# EAGLE design v0.9 (EAGLE 6.1)
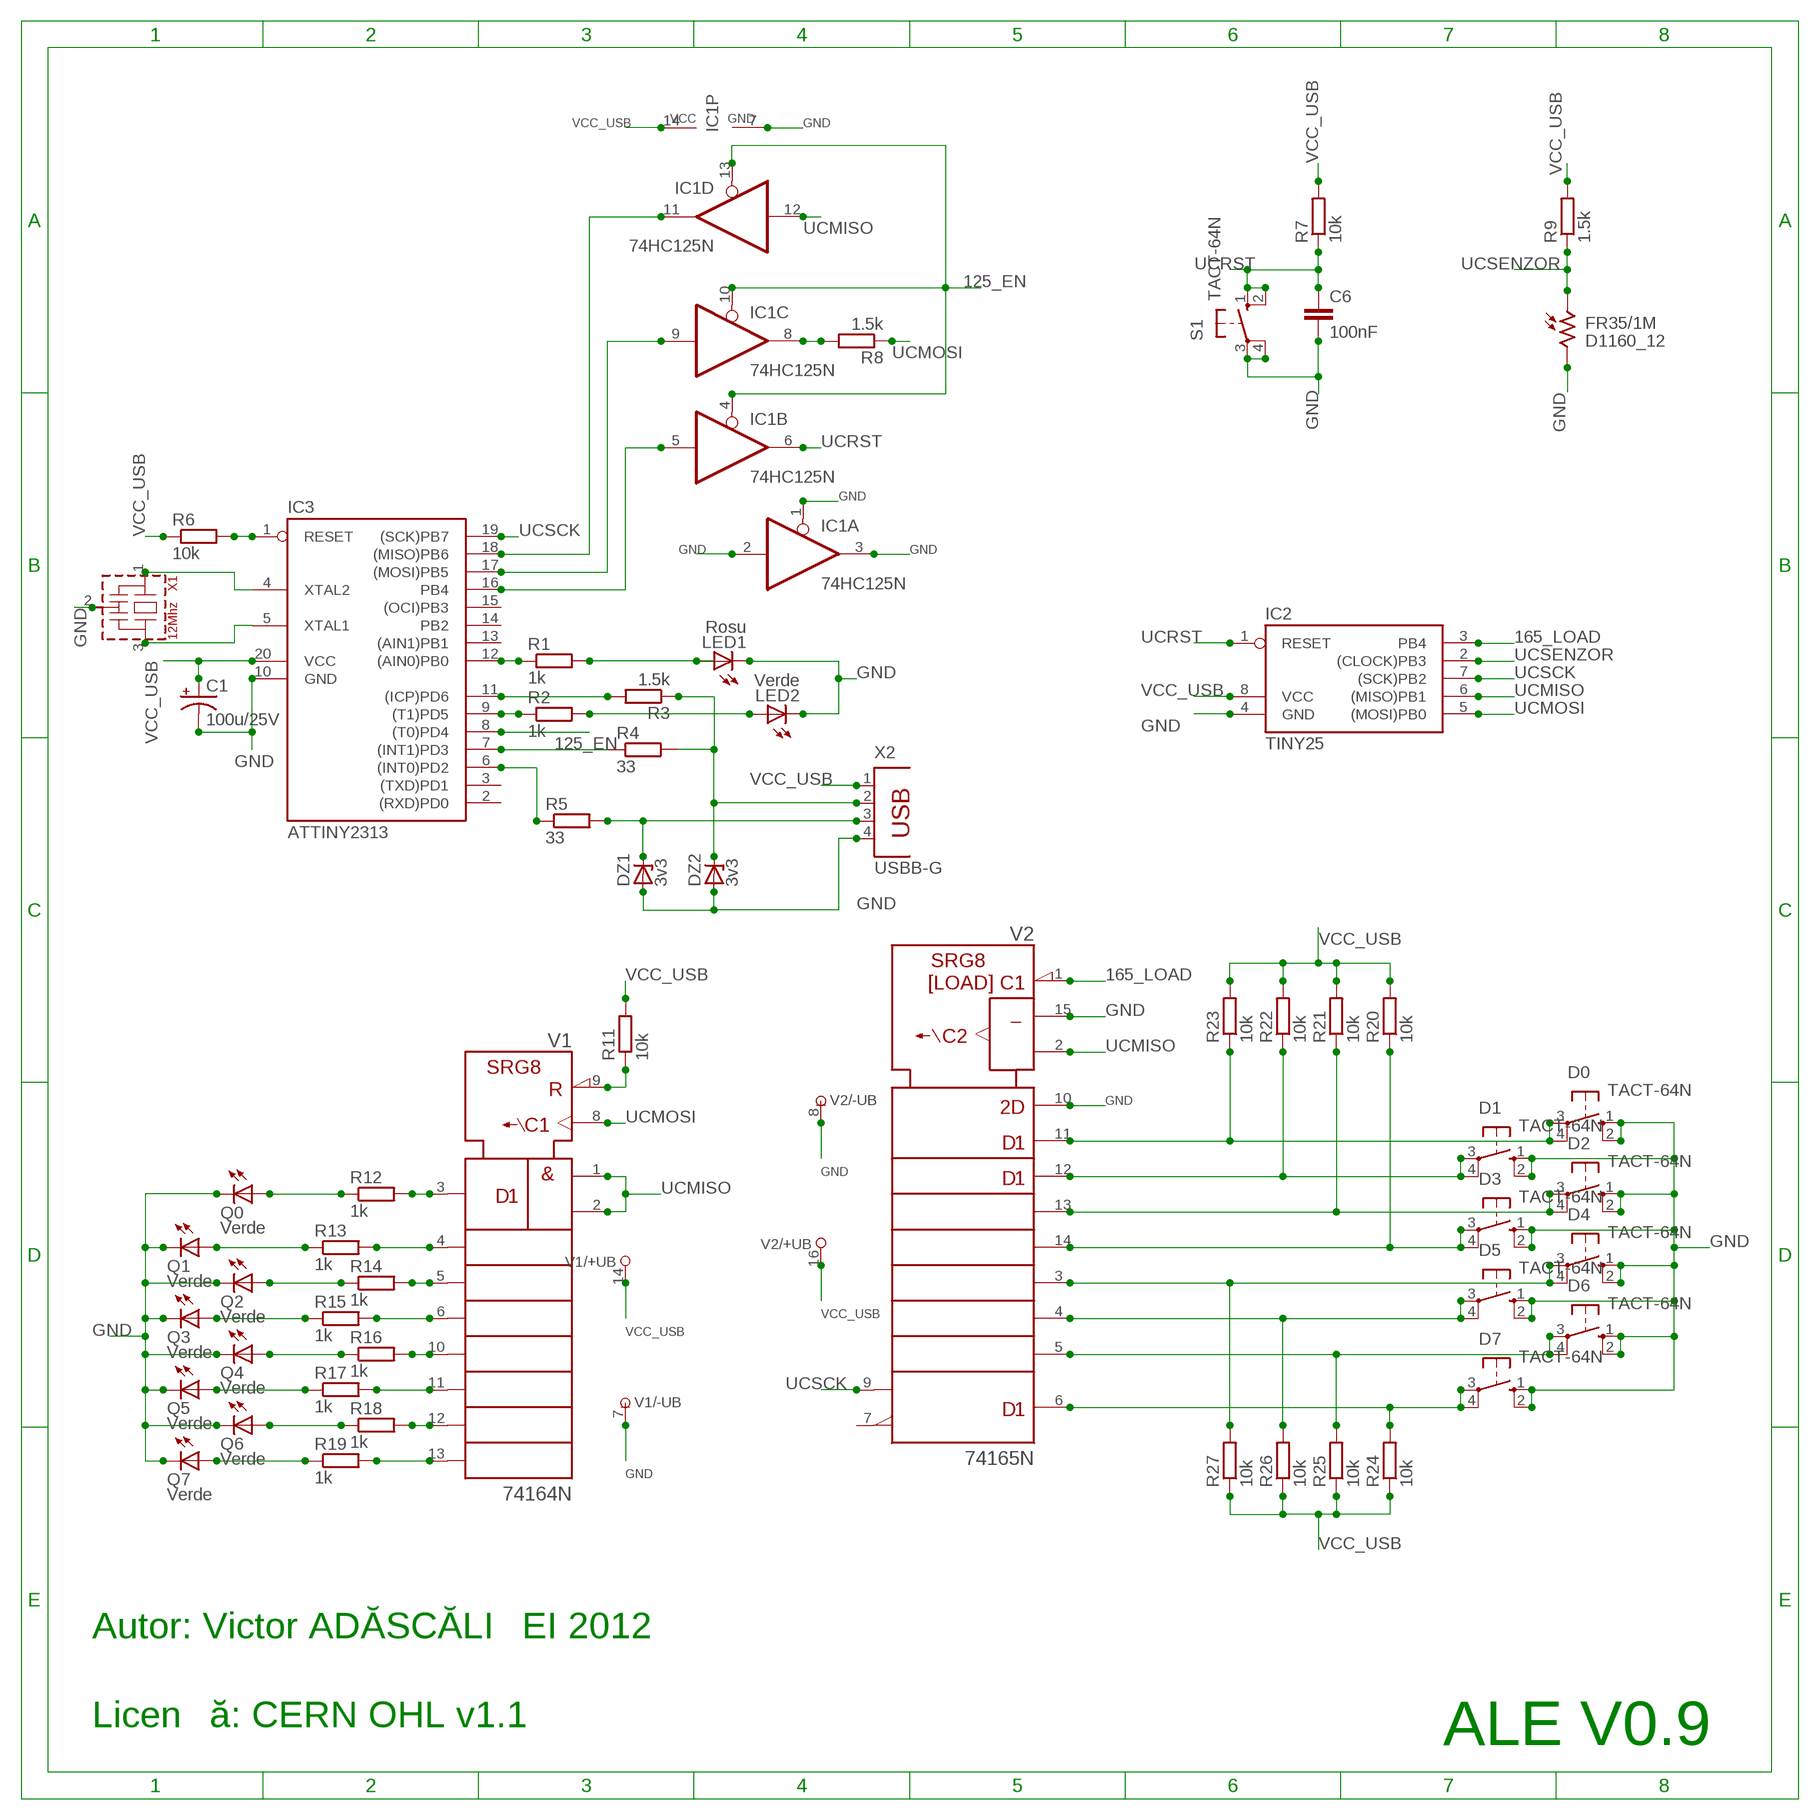
[diagram p0: schematic, sheet 1]

## Parts
C1  100u/25V  CPOL-USE2.5-6  [E2,5-6]
C6  100nF  C-EU050-025X075  [C050-025X075]
D0  TACT-64N  10-XX  [B3F-10XX]
D1  TACT-64N  10-XX  [B3F-10XX]
D2  TACT-64N  10-XX  [B3F-10XX]
D3  TACT-64N  10-XX  [B3F-10XX]
D4  TACT-64N  10-XX  [B3F-10XX]
D5  TACT-64N  10-XX  [B3F-10XX]
D6  TACT-64N  10-XX  [B3F-10XX]
D7  TACT-64N  10-XX  [B3F-10XX]
DZ1  3v3  ZENER-DIODEZD-7.5  [ZDIO-7.5]
DZ2  3v3  ZENER-DIODEZD-7.5  [ZDIO-7.5]
FR35/1M  D1160_12  [D11XX]
IC1  74HC125N  74AC125N  [DIL14]
IC2  TINY25  TINY22P  [DIL08]
IC3  ATTINY2313  AT90S2313P  [DIL20]
LED1  Rosu  LED3MM  [LED3MM]
LED2  Verde  LED3MM  [LED3MM]
Q0  Verde  LED3MM  [LED3MM]
Q1  Verde  LED3MM  [LED3MM]
Q2  Verde  LED3MM  [LED3MM]
Q3  Verde  LED3MM  [LED3MM]
Q4  Verde  LED3MM  [LED3MM]
Q5  Verde  LED3MM  [LED3MM]
Q6  Verde  LED3MM  [LED3MM]
Q7  Verde  LED3MM  [LED3MM]
R1  1k  R-EU_0207/10  [0207/10]
R2  1k  R-EU_0204/5  [0204/5]
R3  1.5k  R-EU_0207/10  [0207/10]
R4  33  R-EU_0207/12  [0207/12]
R5  33  R-EU_0207/10  [0207/10]
R6  10k  R-EU_0207/10  [0207/10]
R7  10k  R-EU_0204/7  [0204/7]
R8  1.5k  R-EU_0207/10  [0207/10]
R9  1.5k  R-EU_0207/12  [0207/12]
R11  10k  R-EU_0207/15  [0207/15]
R12  1k  R-EU_0207/10  [0207/10]
R13  1k  R-EU_0207/10  [0207/10]
R14  1k  R-EU_0207/10  [0207/10]
R15  1k  R-EU_0207/10  [0207/10]
R16  1k  R-EU_0207/10  [0207/10]
R17  1k  R-EU_0207/10  [0207/10]
R18  1k  R-EU_0207/10  [0207/10]
R19  1k  R-EU_0207/10  [0207/10]
R20  10k  R-EU_0207/10  [0207/10]
R21  10k  R-EU_0207/10  [0207/10]
R22  10k  R-EU_0204/7  [0204/7]
R23  10k  R-EU_0204/7  [0204/7]
R24  10k  R-EU_0207/10  [0207/10]
R25  10k  R-EU_0207/10  [0207/10]
R26  10k  R-EU_0207/10  [0207/10]
R27  10k  R-EU_0207/10  [0207/10]
S1  TACT-64N  10-XX  [B3F-10XX]
V1  74164N  [DIL14]
V2  74165N  [DIL16]
X1  12Mhz  CSTLS_X  [CSTLS_X]
X2  USBB-G  PN61729  [PN61729]

## Nets
125_EN: IC1.4(B:OE) IC1.10(C:OE) IC1.13(D:OE) IC3.8((T0)PD4)
165_LOAD: IC2.3(PB4) V2.1(SH/!LD)
GND: C1.- C6.2 D0.1(S) D0.2(S1) D1.1(S) D1.2(S1) D2.1(S) D2.2(S1) D3.1(S) D3.2(S1) D4.1(S) D4.2(S1) D5.1(S) D5.2(S1) D6.1(S) D6.2(S1) D7.1(S) D7.2(S1) DZ1.A DZ2.A FR35/1M.2 IC1.1(A:OE) IC1.2(A:I) IC1.3(A:O) IC1.7(P:GND) IC2.4(GND) IC3.10(GND) LED1.K(C) LED2.K(C) Q0.K(C) Q1.K(C) Q2.K(C) Q3.K(C) Q4.K(C) Q5.K(C) Q6.K(C) Q7.K(C) S1.3(P) S1.4(P1) V1.7(-UB) V2.8(-UB) V2.10(SER) V2.15(CLK_INH) X1.2(VSS) X2.4
N$1: IC1.5(B:I) IC3.16(PB4)
N$2: IC1.9(C:I) IC3.17((MOSI)PB5)
N$4: IC1.8(C:O) R8.2
N$5: IC1.11(D:O) IC3.18((MISO)PB6)
N$6: R11.1 V1.9(!CLR)
N$7: IC3.1(RESET) R6.2
N$8: IC3.7((INT1)PD3) R4.1
N$9: LED2.A R2.2
N$10: IC3.9((T1)PD5) R2.1
N$11: D0.3(P) D0.4(P1) R23.1 V2.11(A)
N$12: Q0.A R12.1
N$13: IC3.12((AIN0)PB0) R1.1
N$14: LED1.A R1.2
N$15: IC3.6((INT0)PD2) R5.1
N$16: IC3.11((ICP)PD6) R3.2
N$17: DZ2.C R3.1 R4.2 X2.2
N$18: IC3.4(XTAL2) X1.1
N$19: DZ1.C R5.2 X2.3
N$20: IC3.5(XTAL1) X1.3
N$21: Q1.A R13.1
N$22: Q2.A R14.1
N$23: Q3.A R15.1
N$24: Q4.A R16.1
N$25: Q5.A R17.1
N$26: Q6.A R18.1
N$27: Q7.A R19.1
N$28: R12.2 V1.3(QA)
N$29: R13.2 V1.4(QB)
N$30: R14.2 V1.5(QC)
N$31: R15.2 V1.6(QD)
N$32: R16.2 V1.10(QE)
N$33: R17.2 V1.11(QF)
N$34: R18.2 V1.12(QG)
N$35: R19.2 V1.13(QH)
N$36: D1.3(P) D1.4(P1) R22.1 V2.12(B)
N$37: D2.3(P) D2.4(P1) R21.1 V2.13(C)
N$38: D3.3(P) D3.4(P1) R20.1 V2.14(D)
N$39: D4.3(P) D4.4(P1) R27.2 V2.3(E)
N$40: D5.3(P) D5.4(P1) R26.2 V2.4(F)
N$41: D6.3(P) D6.4(P1) R25.2 V2.5(G)
N$42: D7.3(P) D7.4(P1) R24.2 V2.6(H)
UCMISO: IC1.12(D:I) IC2.6((MISO)PB1) V1.1(A) V1.2(B) V2.2(CLK)
UCMOSI: IC2.5((MOSI)PB0) R8.1 V1.8(CLK)
UCRST: C6.1 IC1.6(B:O) IC2.1(RESET) R7.1 S1.1(S) S1.2(S1)
UCSCK: IC2.7((SCK)PB2) IC3.19((SCK)PB7) V2.9(QH)
UCSENZOR: FR35/1M.1 IC2.2((CLOCK)PB3) R9.1
VCC_USB: C1.+ IC1.14(P:VCC) IC2.8(VCC) IC3.20(VCC) R6.1 R7.2 R9.2 R11.2 R20.2 R21.2 R22.2 R23.2 R24.1 R25.1 R26.1 R27.1 V1.14(+UB) V2.16(+UB) X2.1
Unconnected: IC3.2((RXD)PD0) IC3.3((TXD)PD1) IC3.13((AIN1)PB1) IC3.14(PB2) IC3.15((OCI)PB3) V2.7(!QH)

## Notes on the sheet
- Autor: Victor ADĂSCĂLIȚEI 2012
- Licență: CERN OHL v1.1
- ALE V0.9

## Library data of the parts
C1 = rcl:CPOL-US: POLARIZED CAPACITOR, American symbol
C6 = rcl:C-EU: CAPACITOR, European symbol
D0 D1-D7 S1 = switch-omron:10-XX: OMRON SWITCH
DZ1 DZ2 = diode:ZENER-DIODE: Z-Diode
FR35/1M = photo-elements:D11: Photo Sensor Oil Burner Control Applications Source: http://optoelectronics.perkinelmer.com/content/Datasheets/DTS_PhotocellsD1160.pdf
IC1 = 74xx-eu:74*125: Quad bus BUFFER, 3-state
IC2 = atmel:TINY22: MICROCONTROLLER 1K ROM 128 bytes RAM 128 bytes EEPROM
IC3 = atmel:AT90S2313: MICROCONTROLLER 2 Kbytes FLASH 128 bytes SRAM 128 bytes EEPROM UART
LED1 LED2 Q0 Q1-Q7 = led:LED: LED OSRAM: - CHIPLED LG R971, LG N971, LY N971, LG Q971, LY Q971, LO R971, LY R971 LH N974, LH R974 LS Q976, LO Q976, LY Q976 LO Q996 - Hyper CHIPLED LW Q18S LB Q993, LB Q99A, LB R99A - SideLED LS A670, LO A670, LY A670, LG A670, LP A670 LB A673, LV A673, LT A673, LW A673 LH A674 LY A675 LS A676, LA A676, LO A676, LY A676, LW A676 LS A679, LY A679, LG A679 - Hyper Micro SIDELED® LS Y876, LA Y876, LO Y876, LY Y876 LT Y87S - SmartLED LW L88C, LW L88S LB L89C, LB L89S, LG L890 LS L89K, LO L89K, LY L89K LS L896, LA L896, LO L896, LY L896 - TOPLED LS T670, LO T670, LY T670, LG T670, LP T670 LSG T670, LSP T670, LSY T670, LOP T670, LYG T670 LG T671, LOG T671, LSG T671 LB T673, LV T673, LT T673, LW T673 LH T674 LS T676, LA T676, LO T676, LY T676, LB T676, LH T676, LSB T676, LW T676 LB T67C, LV T67C, LT T67C, LS T67K, LO T67K, LY T67K, LW E67C LS E67B, LA E67B, LO E67B, LY E67B, LB E67C, LV E67C, LT E67C LW T67C LS T679, LY T679, LG T679 LS T770, LO T770, LY T770, LG T770, LP T770 LB T773, LV T773, LT T773, LW T773 LH T774 LS E675, LA E675, LY E675, LS T675 LS T776, LA T776, LO T776, LY T776, LB T776 LHGB T686 LT T68C, LB T68C - Hyper Mini TOPLED® LB M676 - Mini TOPLED Santana® LG M470 LS M47K, LO M47K, LY M47K Source: http://www.osram.convergy.de LUXEON: - LUMILED® LXK2-PW12-R00, LXK2-PW12-S00, LXK2-PW14-U00, LXK2-PW14-V00 LXK2-PM12-R00, LXK2-PM12-S00, LXK2-PM14-U00 LXK2-PE12-Q00, LXK2-PE12-R00, LXK2-PE12-S00, LXK2-PE14-T00, LXK2-PE14-U00 LXK2-PB12-K00, LXK2-PB12-L00, LXK2-PB12-M00, LXK2-PB14-N00, LXK2-PB14-P00, LXK2-PB14-Q00 LXK2-PR12-L00, LXK2-PR12-M00, LXK2-PR14-Q00, LXK2-PR14-R00 LXK2-PD12-Q00, LXK2-PD12-R00, LXK2-PD12-S00 LXK2-PH12-R00, LXK2-PH12-S00 LXK2-PL12-P00, LXK2-PL12-Q00, LXK2-PL12-R00 Source: www.luxeon.com KINGBRIGHT: KA-3528ASYC Source: www.kingbright.com
R1-R9 R11-R27 = rcl:R-EU_: RESISTOR, European symbol
V1 = 74ttl-din:74*164: 8-bit parallel out SHIFT REGISTER
V2 = 74ttl-din:74*165: 8-bit parallel load SHIFT REGISTER
X1 = murata-resonators:CSTLS_X: Ceramic resonator 16.00 to 70.00 MHz
X2 = con-berg:PN61729: BERG USB connector

## Board
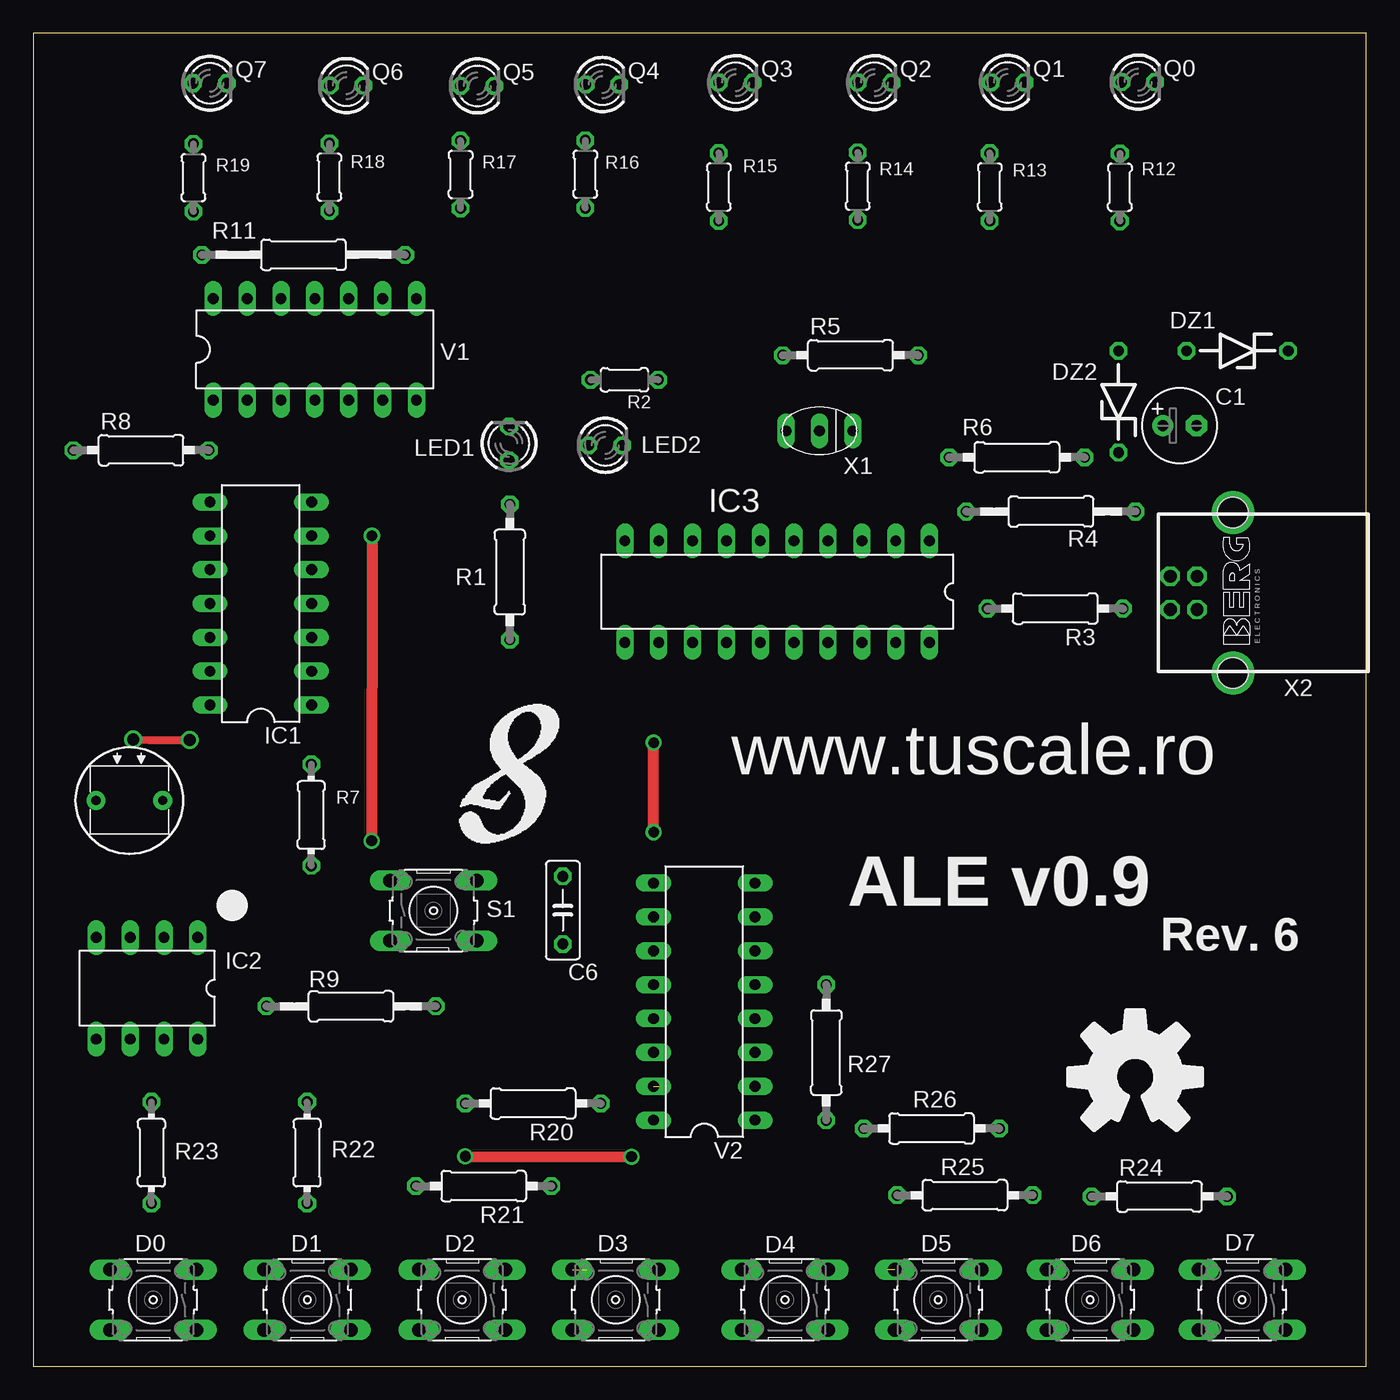
[diagram p1: board, top side]
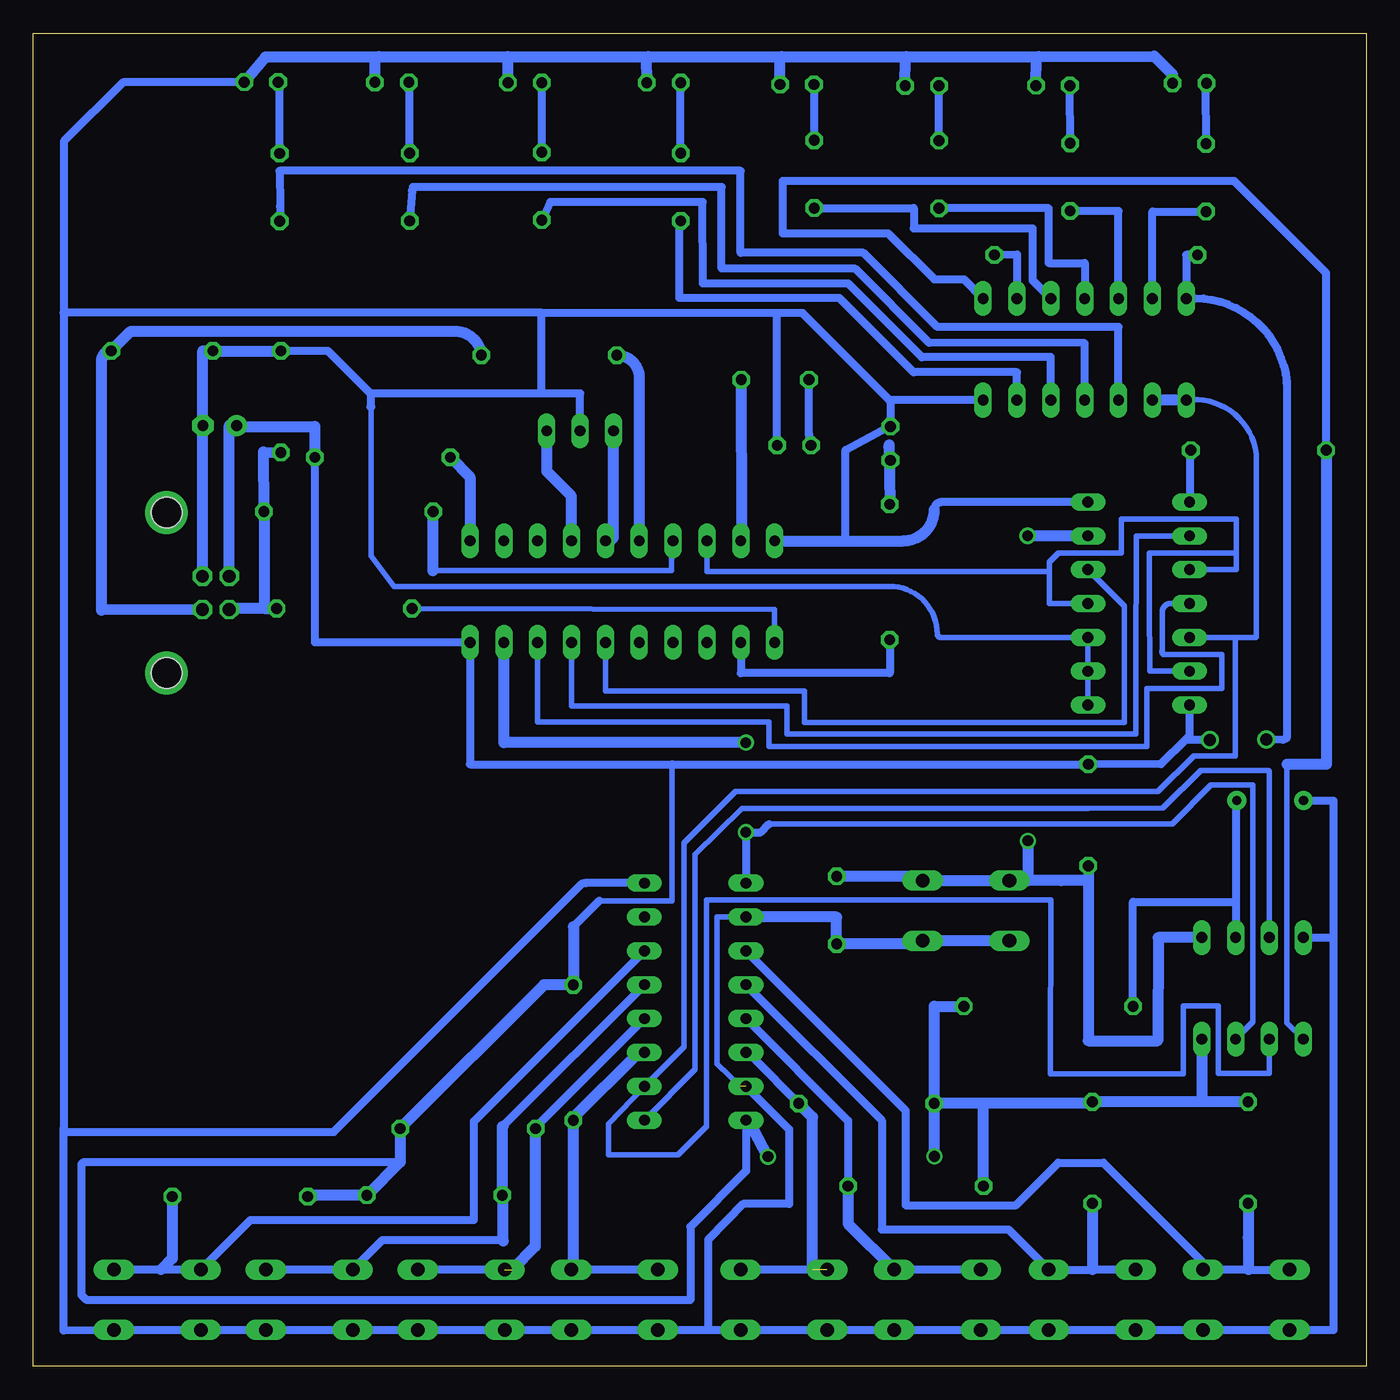
[diagram p2: board, bottom side, seen from below]

Size 100 x 100 mm. Coordinates in mm from the lower left corner, seen from the top.
Outline: 0,0 100,0 100,100 0,100 0,0
Copper layers (1*16): Top 0.035mm / dielectric 1.5mm / Bottom 0.035mm
Design rules "default": minimum track width 0.25mm, minimum drill 0.6mm, track to track 0.25mm, track to pad 8mil, pad to pad 8mil, via to via 8mil, smd to smd 8mil, copper to edge 40mil, drill to drill 8mil, minimum pad ring 10mil, minimum via ring 8mil, stop-mask expansion 4mil, vias tented up to drill 0mil, thermal gap 10mil

### Footprints (pad centres in the part's own frame; a part is rotated, then mirrored left to right if it is on the bottom)
E2,5-6 = drill 0.813 pad 1.6: + -1.27,0 | drill 0.813 pad 1.6 octagon: - 1.27,0
C050-025X075 = drill 0.813 octagon: 1 -2.54,0; 2 2.54,0
B3F-10XX = drill 1.016 long: 1 -3.251,2.261; 2 3.251,2.261; 3 -3.251,-2.261; 4 3.251,-2.261
ZDIO-7.5 = drill 0.813 octagon: A 3.81,0; C -3.81,0
D11XX = drill 0.7 pad 1.4: 1 -2.5,0; 2 2.5,0
DIL14 = drill 0.813 long: 1 -7.62,-3.81; 2 -5.08,-3.81; 3 -2.54,-3.81; 4 0,-3.81; 5 2.54,-3.81; 6 5.08,-3.81; 7 7.62,-3.81; 8 7.62,3.81; 9 5.08,3.81; 10 2.54,3.81; 11 0,3.81; 12 -2.54,3.81; 13 -5.08,3.81; 14 -7.62,3.81
DIL08 = drill 0.813 long: 1 -3.81,-3.81; 2 -1.27,-3.81; 3 1.27,-3.81; 4 3.81,-3.81; 5 3.81,3.81; 6 1.27,3.81; 7 -1.27,3.81; 8 -3.81,3.81
DIL20 = drill 0.813 long: 1 -11.43,-3.81; 2 -8.89,-3.81; 3 -6.35,-3.81; 4 -3.81,-3.81; 5 -1.27,-3.81; 6 1.27,-3.81; 7 3.81,-3.81; 8 6.35,-3.81; 9 8.89,-3.81; 10 11.43,-3.81; 11 11.43,3.81; 12 8.89,3.81; 13 6.35,3.81; 14 3.81,3.81; 15 1.27,3.81; 16 -1.27,3.81; 17 -3.81,3.81; 18 -6.35,3.81; 19 -8.89,3.81; 20 -11.43,3.81
LED3MM = drill 0.813 octagon: A -1.27,0; K 1.27,0
0207/10 = drill 0.813 octagon: 1 -5.08,0; 2 5.08,0
0204/5 = drill 0.813 octagon: 1 -2.54,0; 2 2.54,0
0207/12 = drill 0.813 octagon: 1 -6.35,0; 2 6.35,0
0204/7 = drill 0.813 octagon: 1 -3.81,0; 2 3.81,0
0207/15 = drill 0.813 octagon: 1 -7.62,0; 2 7.62,0
DIL16 = drill 0.813 long: 1 -8.89,-3.81; 2 -6.35,-3.81; 3 -3.81,-3.81; 4 -1.27,-3.81; 5 1.27,-3.81; 6 3.81,-3.81; 7 6.35,-3.81; 8 8.89,-3.81; 9 8.89,3.81; 10 6.35,3.81; 11 3.81,3.81; 12 1.27,3.81; 13 -1.27,3.81; 14 -3.81,3.81; 15 -6.35,3.81; 16 -8.89,3.81
CSTLS_X = drill 0.813 long: 1 -2.5,0; 2 0,0; 3 2.5,0
PN61729 = drill 0.95 octagon: 1 1.25,4.71; 2 -1.25,4.71; 3 -1.25,2.71; 4 1.25,2.71 | hole 2.3: -6.02,0; 6.02,0

### Placement (x,y rotation side)
C1  86.01,70.57 0 top
C6  39.73,34.21 270 top
D0  8.99,4.98 180 top
D1  20.56,4.98 180 top
D2  32.16,4.98 180 top
D3  43.69,4.98 180 top
D4  56.39,4.98 180 top
D5  67.89,4.98 180 top
D6  79.29,4.98 180 top
D7  90.69,4.98 180 top
DZ1  90.34,76.18 180 top
DZ2  81.42,72.36 90 top
FR35/1M  7.21,42.44 180 top
IC1  17.06,57.22 90 top
IC2  8.53,28.35 180 top
IC3  55.81,58.11 180 top
LED1  35.69,69.23 90 top
LED2  42.92,69.09 0 top
Q0  82.9,96.34 0 top
Q1  73.1,96.32 0 top
Q2  63.12,96.3 0 top
Q3  52.7,96.3 0 top
Q4  42.7,96.16 0 top
Q5  33.32,96.06 0 top
Q6  23.5,96.08 0 top
Q7  13.25,96.26 0 top
R1  35.75,59.58 90 top
R2  44.35,74.01 180 top
R3  76.67,56.84 180 top
R4  76.35,64.12 0 top
R5  61.31,75.85 0 top
R6  73.79,68.19 180 top
R7  20.85,41.35 90 top
R8  8.08,68.72 0 top
R9  23.84,27 0 top
R11  20.27,83.38 180 top
R12  1k  [0204/5]  81.52,88.45 270 top
R13  1k  [0204/5]  71.76,88.47 270 top
R14  1k  [0204/5]  61.85,88.53 270 top
R15  1k  [0204/5]  51.43,88.47 270 top
R16  1k  [0204/5]  41.41,89.43 270 top
R17  1k  [0204/5]  32.05,89.41 270 top
R18  1k  [0204/5]  22.21,89.21 270 top
R19  1k  [0204/5]  12.01,89.17 270 top
R20  37.49,19.71 180 top
R21  33.79,13.51 180 top
R22  20.54,16.02 90 top
R23  8.86,16.02 90 top
R24  84.49,12.73 0 top
R25  69.89,12.83 180 top
R26  67.39,17.83 180 top
R27  59.49,23.53 270 top
S1  30.02,34.18 0 top
V1  21.12,76.29 0 top
V2  50.34,27.35 90 top
X1  58.98,70.18 180 top
X2  90.01,58.02 90 top

### Tracks (layer width: path | path; a pad name or v marks a point on that pad's centre or on a via)
125_EN
  Bottom 0.406: IC1.10 9.76,59.76 9.76,61 | IC1.13 16.25,52.14 16.26,57.29 16.26,60.99 9.77,60.99 9.76,61 | 9.76,61 9.76,63.56 18.36,63.56 18.36,61 23.1,61 23.78,60.32 23.78,59.62 | IC1.4 23.78,57.22 23.78,59.62 | IC3.8 49.46,59.62 23.78,59.62
165_LOAD
  Bottom 0.406: V2.1 50.34,22.27 50.34,38.38 46.82,41.86 20.84,41.86 15.25,41.87 12.4,44.7 7.35,44.7 7.26,44.61 IC2.3
GND  (1 unrouted)
  Bottom 0.406: IC1.1 IC1.2 IC1.3 31.92,54.68 arc90 32.18,54.94 arc-90 35.75,58.51 72.92,58.51 74.65,60.77 74.65,71.96 | 46.96,21 48.7,22.67 48.7,33.7 V2.10
  Bottom 0.61: X1.2 58.98,72.98 61.88,72.98 | 61.88,72.98 74.7,72.98 | 74.7,72.98 74.7,71.96 74.65,71.96 | 74.7,72.98 77.89,76.17 DZ2.A | 44.2,79 42.28,79.01 35.78,72.48 35.65,72.48 | 44.2,79 61.86,79 61.88,79.04 | LED2.K 44.2,79 | V1.7 35.65,72.48 | 61.88,79.04 97.73,79.04 | FR35/1M.2 2.44,42.44 2.44,32.16 | 2.44,32.16 2.44,2.72 D0.2 D0.1 D1.2 D1.1 D2.2 D2.1 D3.2 D3.1 49.36,2.72 | IC2.4 2.44,32.16 | 49.36,2.72 D4.2 D4.1 D5.2 D5.1 D6.2 D6.1 D7.2 D7.1 97.75,2.69 97.75,17.58 | 97.73,79.04 97.73,17.84 97.75,17.58 | 97.75,17.58 77.46,17.58 58.88,36.18 58.56,36.24 V2.8 | 61.88,72.98 61.88,79.04 | V2.15 43.3,17.77 43.3,12.18 46.74,12.18 49.36,9.51 49.36,2.72 | 34.74,61.92 39.04,61.92 arc90 39.06,61.94 39.06,68.75 35.8,70.5 LED1.K 35.65,70.54 35.65,72.48 | IC1.7 31.82,64.84 arc-90 32.4,64.26 | Q0.K 93.26,96.33 97.7,91.89 97.73,79.04
  Bottom 0.813: V2.10 39.73,33.7 C6.2 33.27,31.67 S1.4 S1.3 | DZ2.A DZ1.A 87.28,76.18 C1.- 87.3,70.57 X2.4 | Q0.K 82.58,98.23 74.08,98.25 | 74.08,98.25 64.39,98.25 | 64.39,98.25 53.85,98.25 | 53.85,98.25 43.86,98.25 | 43.86,98.25 34.53,98.25 | 34.53,98.25 24.57,98.25 | 24.57,98.25 15.91,98.29 14.52,96.9 Q7.K | Q1.K 74.37,98.17 74.08,98.25 | Q2.K 64.39,98.25 | Q3.K 53.99,98.23 53.85,98.25 | Q4.K 43.97,98.16 43.86,98.25 | Q5.K 34.57,98.22 34.53,98.25 | Q6.K 24.75,98.24 24.57,98.25 | IC3.10 34.74,61.92 arc-90 32.4,64.26
N$1
  Bottom 0.406: IC1.5 18.16,57.05 18.16,48.31 42.16,48.31 42.16,50.65 57.08,50.65 IC3.16
N$2
  Bottom 0.406: IC1.9 17.26,62.28 17.29,52.09 17.3,47.95 17.29,47.45 43.47,47.45 43.47,49.54 59.62,49.54 IC3.17
N$3  (via drill 2.2 pad 1.02)
  other vias: 90.01,52
N$4
  Bottom 0.61: R8.2 13.25,68.74 IC1.8
N$5
  Bottom 0.406: IC1.11 14.75,57.22 arc-90 15.3,56.49 15.3,53.7 arc-90 15.16,53.38 10.82,53.38 10.82,50.84 16.46,50.84 16.47,47.03 16.47,46.48 44.82,46.48 44.82,48.32 62.16,48.32 IC3.18
N$6
  Bottom 0.61: R11.1 26.2,83.42 V1.9
N$7
  Bottom 0.813: R6.2 67.24,66.72 IC3.1
N$8
  Bottom 0.406: IC3.7 52.11,62.03 52.11,59.68 70.01,59.68 | R4.1
  Bottom 0.813: 70.01,59.68 R4.1
N$9
  Bottom 0.61: LED2.A 41.79,69.92 R2.2
N$10
  Bottom 0.813: R2.1 46.86,63.08 IC3.9
N$11
  Bottom 0.61: D0.4 8.84,7.24 11.69,7.24 | 11.69,7.24 D0.3 12.2,7.24 | V2.11 34.56,19.19 34.56,12.08 26.28,12.08 23.1,15.26 19.71,15.26 11.69,7.24
  Bottom 0.813: 8.84,7.24 8.84,9.64 8.86,9.66 R23.1
N$12
  Bottom 0.61: R12.1 81.51,96.18 Q0.A
N$13
  Bottom 0.61: R1.1 35.75,52 46.92,52 IC3.12
N$14
  Bottom 0.813: LED1.A 35.79,69.11 R1.2
N$15
  Bottom 0.813: R5.1 arc90 54.54,74.16 IC3.6
N$16
  Bottom 0.406: IC3.11 44.38,56.76 71.77,56.83 arc90 R3.2
N$17
  Bottom 0.406: R4.2
  Bottom 0.813: DZ2.C 82.72,68.59 R4.2 82.7,56.85 R3.1 85.27,56.84 X2.2
N$18
  Bottom 0.813: IC3.4 59.62,65.28 61.46,67.12 61.46,70.16 X1.1
N$19
  Bottom 0.813: X2.3 94.88,56.72 94.88,75.45 arc90 DZ1.C 92.69,77.64 68.54,77.64 arc90 R5.2
N$20
  Bottom 0.813: IC3.5 56.98,61.82 56.98,61.66 56.48,62.16 X1.3
N$21
  Bottom 0.61: R13.1 71.77,95.99 Q1.A
N$22
  Bottom 0.61: R14.1 Q2.A
N$23
  Bottom 0.61: R15.1 Q3.A
N$24
  Bottom 0.61: R16.1 41.41,95.75 Q4.A
N$25
  Bottom 0.61: R17.1 Q5.A
N$26
  Bottom 0.61: R18.1 22.23,95.91 Q6.A
N$27
  Bottom 0.61: R19.1 12.02,96.08 Q7.A
N$28
  Bottom 0.61: V1.3 18.58,77.97 32.16,77.97 37.72,83.53 46.93,83.53 46.94,89.68 81.52,89.68 81.5,87.01 R12.2
N$29
  Bottom 0.61: V1.4 21.12,76.75 32.79,76.79 38.33,82.33 48.36,82.35 48.36,88.46 71.52,88.46 71.6,88.21 R13.2
N$30
  Bottom 0.61: V1.5 23.66,75.71 33.35,75.7 38.86,81.22 49.76,81.22 49.78,87.34 61.22,87.34 R14.2
N$31
  Bottom 0.61: V1.6 26.2,74.57 33.96,74.57 39.52,80.14 51.54,80.14 51.54,85.82 R15.2
N$32
  Bottom 0.61: V1.10 25.04,81.48 25.04,85.37 33.94,85.37 33.94,86.89 R16.2
N$33
  Bottom 0.61: V1.11 21.12,82.77 23.82,82.77 23.82,86.87 R17.2
N$34
  Bottom 0.61: V1.12 18.58,86.67 R18.2
N$35
  Bottom 0.61: V1.13 16.04,86.63 R19.2
N$36
  Bottom 0.61: D1.4 20.54,7.24 D1.3 26.81,10.24 36.34,10.24 36.34,18.43 V2.12
  Bottom 0.813: R22.1 20.54,7.24
N$37
  Bottom 0.61: D2.4 D2.3 | V2.13 38.87,18.42 R21.1
  Bottom 0.813: R21.1 38.87,10.7 D2.3
N$38  (1 unrouted)
  Bottom 0.406: R20.1 42.7,19.71
  Bottom 0.61: D3.4 D3.3 | V2.14 46.4,23.54 42.21,19.35
  Bottom 0.813: 41.54,7.24 41.54,18.68 42.21,19.35 R20.1
N$39
  Bottom 0.61: D4.4 D4.3
  Bottom 0.813: D4.3 59.49,7.39 R27.2 59.49,18.63 54.68,23.44 54.25,23.44 V2.3
N$40  (1 unrouted)
  Bottom 0.406: 62.34,17.89 62.3,17.93 62.3,17.84 R26.2
  Bottom 0.61: D5.4 D5.3 | V2.4 62.31,17.92 R26.2
  Bottom 0.813: 62.34,17.89 62.34,8.98 64.08,7.24
N$41
  Bottom 0.61: D6.3 D6.4 73.83,9.45 64.81,9.45 | V2.5 64.74,18.03
  Bottom 0.813: 64.74,9.38 64.81,9.45 R25.2 64.81,17.96 64.74,18.03
N$42
  Bottom 0.61: D7.3 90.42,7.24 D7.4 83.7,10.98 66.94,10.98 66.94,18.37 V2.6
  Bottom 0.813: R24.2 89.57,8.09 90.42,7.24
N$43  (via drill 2.2 pad 1.02)
  other vias: 90.01,64.05
UCMISO
  Bottom 0.406: IC2.6 7.26,21.97 11.11,21.97 11.11,27.04 13.71,27.04 13.71,21.92 23.71,21.92 23.67,34.97 49.5,34.97 49.5,18 51.65,15.85 56.85,15.85 56.85,18.18 V2.2 51.2,23.95 51.2,39.24 47.32,43.12 15.63,43.12 12.92,45.8 9.82,45.8 9.82,54.68 | 9.82,54.68 IC1.12 | V1.1 arc90 8.24,68.45 8.26,54.7 arc90 8.28,54.68 9.82,54.68
  Bottom 0.813: V1.1 V1.2
UCMOSI
  Bottom 0.406: IC2.5 5.95,25.77 5.95,45.16
  Bottom 0.61: V1.8 30.18,81.54 32.41,81.54 35.87,85 43.78,85 43.78,88.94 9.93,88.94 3,82.01 R8.1
  Bottom 0.813: R8.1 2.99,45.16 5.95,45.16
UCRST  (via drill 0.8)
  Top 0.813: v25.4,62.3 v25.38,39.42
  Bottom 0.406: R7.1 21,36.44
  Bottom 0.813: IC2.1 15.61,32.16 15.65,24.42 20.85,24.42 R7.1 | 21,36.44 22.88,36.44 S1.1 | v25.38,39.42 25.38,36.44 S1.1 | IC1.6 v25.4,62.3 | C6.1 33.27,36.75 S1.2 S1.1
UCSCK  (via drill 0.8)
  Top 0.813: v46.54,40.06 v46.54,46.78
  Bottom 0.406: IC2.7 8.5,25.84 8.5,43.61 11.65,43.61 14.56,40.68 44.8,40.68 44.86,40.68
  Bottom 0.61: 44.8,40.68 45.42,40.06 v46.54,40.06 V2.9
  Bottom 0.813: v46.54,46.78 64.7,46.78 IC3.19
UCSENZOR
  Bottom 0.61: FR35/1M.1 9.8,42.44 9.8,34.84 | 9.8,34.84 IC2.2 | R9.1 17.49,34.84 9.8,34.84
  Bottom 0.813: 17.55,27 R9.1
VCC_USB  (via drill 0.8, 0.9 pad 0.81)
  Top 0.61: v11.72,46.98 8.72,46.98 v7.48,47.02
  Top 0.813: v32.4,15.74 v44.88,15.72
  Bottom 0.406: 52.08,45.16 52.08,34.92 57.54,34.92 | R27.1
  Bottom 0.61: R11.2 13.5,83.38 V1.14 arc90 5.96,73.79 5.96,47.12 6.26,47 v7.48,47.02 | v11.72,46.98 13.58,46.98 | 57.54,34.92 59.48,32.98 | 13.58,46.98 15.4,45.17 R7.2 52.08,45.16 67.24,45.16 IC3.20 78.87,54.3 R6.1 | V2.16 46.53,14.64 50.71,10.46 50.71,4.95 95.99,4.95 96.37,5.33 96.37,15.17 96.21,15.33 72.47,15.33 | 13.58,46.98 13.25,47.31 IC1.14
  Bottom 0.813: R23.2 8.79,19.84 12.34,19.84 | IC2.8 12.34,19.84 | 12.34,19.84 R22.2 20.68,19.71 28.71,19.71 | 28.71,19.71 R20.2 32.41,27 | R21.2 28.71,19.71 | 32.41,27 R9.2 | v44.88,15.72 45.96,17.78 46.02,18.46 V2.16 | v32.4,15.74 32.38,15.9 32.41,27 | 59.48,32.98 R27.1 61.69,28.61 R26.1 72.47,15.33 R25.1 79.31,12.83 R24.1 | R6.1 78.87,70.5 84.74,70.5 C1.+ 85.3,70.57 X2.1

### Text on the board
tPlace: www.tuscale.ro | ALE v0.9 | Rev. 6